# Altium project X.PrjPcb
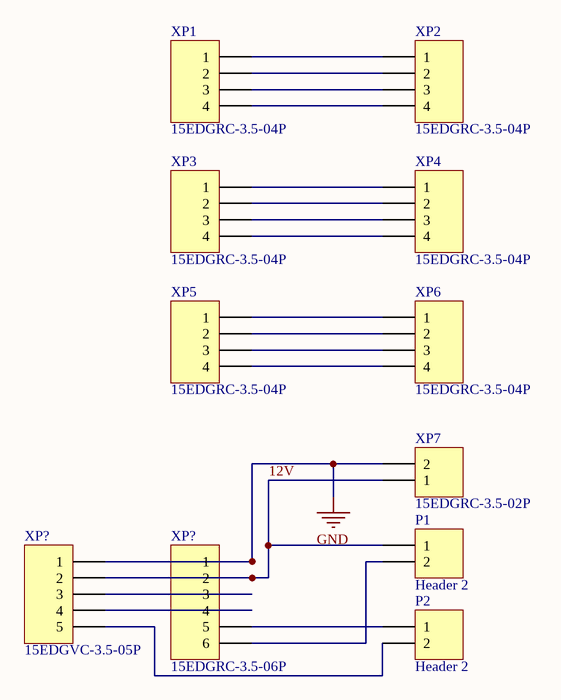
[diagram p0: X.SchDoc]
1 sheet, 11 parts. Net scope: global (net labels, ports and power ports of the same name join across sheets).
Board file: X.PcbDoc

## Sheet X.SchDoc
size A4

### Parts
(Parts that share a designator on the sheet are numbered #1, #2 ... from top to bottom, then left to right.)
P1  Header 2  [HDR1X2]
P2  Header 2  [HDR1X2]
XP1  15EDGRC-3.5-04P  [RR_CONN_15EDGRC-3.5-04P]
XP2  15EDGRC-3.5-04P  [RR_CONN_15EDGRC-3.5-04P]
XP3  15EDGRC-3.5-04P  [RR_CONN_15EDGRC-3.5-04P]
XP4  15EDGRC-3.5-04P  [RR_CONN_15EDGRC-3.5-04P]
XP5  15EDGRC-3.5-04P  [RR_CONN_15EDGRC-3.5-04P]
XP6  15EDGRC-3.5-04P  [RR_CONN_15EDGRC-3.5-04P]
XP7  15EDGRC-3.5-02P  [RR_CONN_15EDGRC-3.5-02P]
XP?#1  15EDGVC-3.5-05P  [RR_CONN_15EDGVC-3.5-05P]
XP?#2  15EDGRC-3.5-06P  [RR_CONN_15EDGRC-3.5-06P]

### Nets
GND: XP7.2 XP?#1.1 XP?#2.1
12V: P1.1 XP7.1 XP?#1.2 XP?#2.2
NetP1_2: P1.2 XP?#2.6
NetP2_1: P2.1 XP?#2.5
NetP2_2: P2.2 XP?#1.5
NetXP1_1: XP1.1 XP2.1
NetXP1_2: XP1.2 XP2.2
NetXP1_3: XP1.3 XP2.3
NetXP1_4: XP1.4 XP2.4
NetXP3_1: XP3.1 XP4.1
NetXP3_2: XP3.2 XP4.2
NetXP3_3: XP3.3 XP4.3
NetXP3_4: XP3.4 XP4.4
NetXP5_1: XP5.1 XP6.1
NetXP5_2: XP5.2 XP6.2
NetXP5_3: XP5.3 XP6.3
NetXP5_4: XP5.4 XP6.4
NetXP?#1_3: XP?#1.3 XP?#2.3
NetXP?#1_4: XP?#1.4 XP?#2.4

### Library data of the parts
P1 P2 = Header 2: Header, 2-Pin; LatestRevisionDate: 17-Jul-2002; LatestRevisionNote: Re-released for DXP Platform.; Publisher: Altium Limited
XP1-XP6 = 15EDGRC-3.5-04P: CONN 15EDGRC-3.5-04P R-HEADER; Manufacturer: DEGSON ELECTRONICS; Order Number: 15EDGRC-3.5-04P-14-00A(H); Value: Pluggable terminal block; 3.5mm; ways:4; angled 90°; socket; male; Cost: 0,32; Package: 4x3.5MM pitch
XP7 = 15EDGRC-3.5-02P: CONN 15EDGRC-3.5-02P R-HEADER; Manufacturer: DEGSON ELECTRONICS; Order Number: 15EDGRC-3.5-02P-14-00A(H); Value: Pluggable terminal block; 3.5mm; ways:2; angled 90°; socket; male; Cost: 0,32; Package: 2x3.5MM pitch
XP?#1 = 15EDGVC-3.5-05P: CONN 15EDGVC-3.5-05P HEADER; Manufacturer: DEGSON ELECTRONICS; Order Number: 15EDGVC-3.5-05P-14-00A(H); Value: Pluggable terminal block; 3.5mm; ways:5; straight; socket; male; Cost: 0,34; Package: 5x3.5MM pitch
XP?#2 = 15EDGRC-3.5-06P: CONN 15EDGRC-3.5-06P R-HEADER; Manufacturer: DEGSON ELECTRONICS; Order Number: 15EDGRC-3.5-06P-14-00A(H); Value: Pluggable terminal block; 3.5mm; ways:6; angled 90°; socket; male; Cost: 0,5; Package: 6x3.5MM pitch